# Altium schematic sheet FPGA.SchDoc
size C
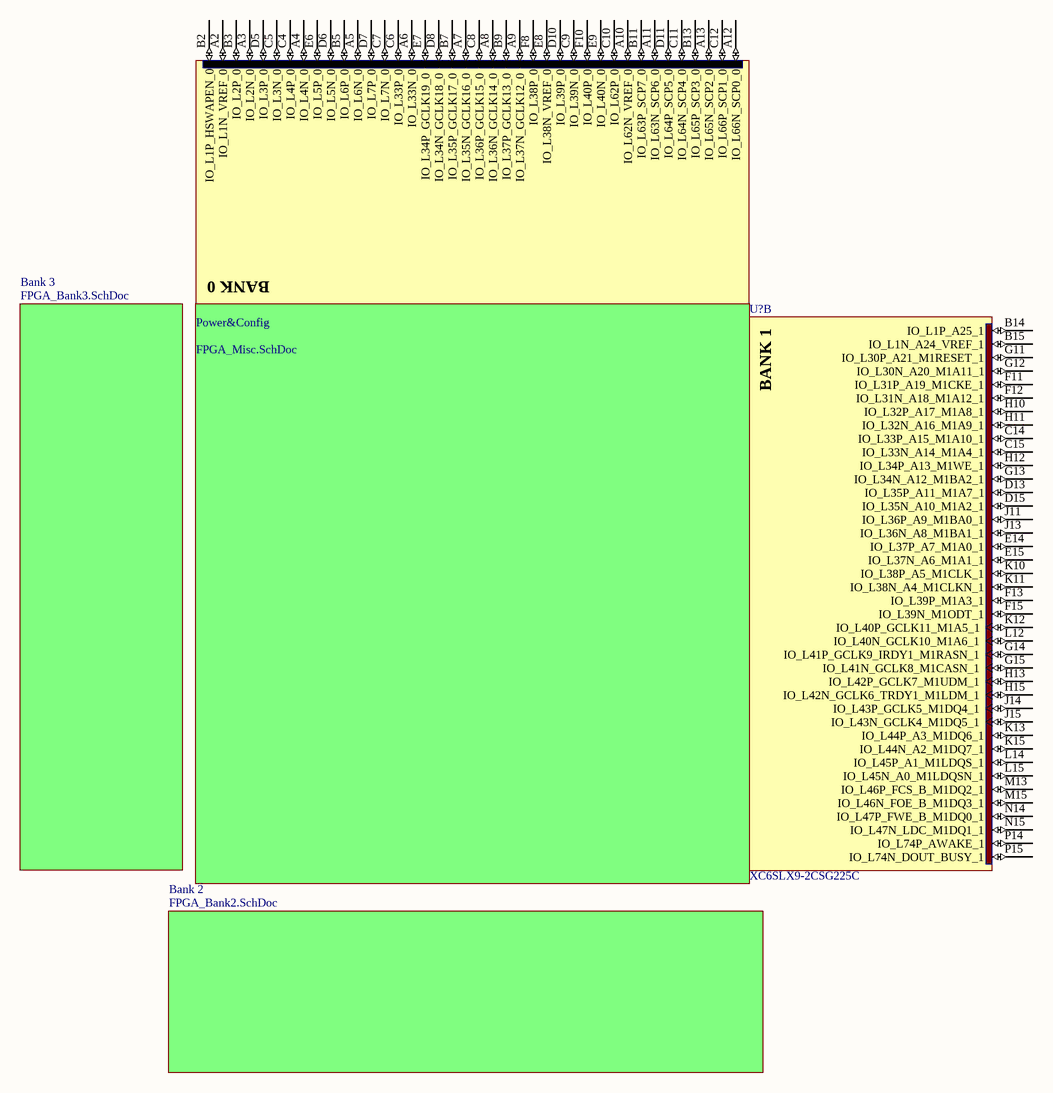
[diagram p0: FPGA.SchDoc]

## Parts
(Parts that share a designator on the sheet are numbered #1, #2 ... from top to bottom, then left to right.)
U?#1  XC6SLX9-2CSG225C  [CSG225]  (part A of 7)
U?#2  XC6SLX9-2CSG225C  [CSG225]  (part B of 7)

## Sub-sheets
Bank 2 = FPGA_Bank2.SchDoc: no entries
Bank 3 = FPGA_Bank3.SchDoc: no entries
Power&Config = FPGA_Misc.SchDoc: no entries

## Nets

Not connected (* = marked no-connect by the designer): U?#1 A2(IO_L1N_VREF_0) A3(IO_L2N_0) A4(IO_L4N_0) A5(IO_L6N_0) A6(IO_L33N_0) A7(IO_L35N_GCLK16_0) A8(IO_L36N_GCLK14_0) A9(IO_L37N_GCLK12_0) A10(IO_L62N_VREF_0) A11(IO_L63N_SCP6_0) A12(IO_L66N_SCP0_0) A13(IO_L65N_SCP2_0) B2(IO_L1P_HSWAPEN_0) B3(IO_L2P_0) B5(IO_L6P_0) B7(IO_L35P_GCLK17_0) B9(IO_L37P_GCLK13_0) B11(IO_L63P_SCP7_0) B13(IO_L65P_SCP3_0) C4(IO_L4P_0) C5(IO_L3N_0) C6(IO_L33P_0) C7(IO_L7N_0) C8(IO_L36P_GCLK15_0) C9(IO_L39N_0) C10(IO_L62P_0) C11(IO_L64N_SCP4_0) C12(IO_L66P_SCP1_0) D5(IO_L3P_0) D6(IO_L5N_0) D7(IO_L7P_0) D8(IO_L34N_GCLK18_0) D10(IO_L39P_0) D11(IO_L64P_SCP5_0) E6(IO_L5P_0) E7(IO_L34P_GCLK19_0) E8(IO_L38N_VREF_0) E9(IO_L40N_0) F8(IO_L38P_0) F10(IO_L40P_0); U?#2 B14(IO_L1P_A25_1) B15(IO_L1N_A24_VREF_1) C14(IO_L33P_A15_M1A10_1) C15(IO_L33N_A14_M1A4_1) D13(IO_L35P_A11_M1A7_1) D15(IO_L35N_A10_M1A2_1) E14(IO_L37P_A7_M1A0_1) E15(IO_L37N_A6_M1A1_1) F11(IO_L31P_A19_M1CKE_1) F12(IO_L31N_A18_M1A12_1) F13(IO_L39P_M1A3_1) F15(IO_L39N_M1ODT_1) G11(IO_L30P_A21_M1RESET_1) G12(IO_L30N_A20_M1A11_1) G13(IO_L34N_A12_M1BA2_1) G14(IO_L41P_GCLK9_IRDY1_M1RASN_1) G15(IO_L41N_GCLK8_M1CASN_1) H10(IO_L32P_A17_M1A8_1) H11(IO_L32N_A16_M1A9_1) H12(IO_L34P_A13_M1WE_1) H13(IO_L42P_GCLK7_M1UDM_1) H15(IO_L42N_GCLK6_TRDY1_M1LDM_1) J11(IO_L36P_A9_M1BA0_1) J13(IO_L36N_A8_M1BA1_1) J14(IO_L43P_GCLK5_M1DQ4_1) J15(IO_L43N_GCLK4_M1DQ5_1) K10(IO_L38P_A5_M1CLK_1) K11(IO_L38N_A4_M1CLKN_1) K12(IO_L40P_GCLK11_M1A5_1) K13(IO_L44P_A3_M1DQ6_1) K15(IO_L44N_A2_M1DQ7_1) L12(IO_L40N_GCLK10_M1A6_1) L14(IO_L45P_A1_M1LDQS_1) L15(IO_L45N_A0_M1LDQSN_1) M13(IO_L46P_FCS_B_M1DQ2_1) M15(IO_L46N_FOE_B_M1DQ3_1) N14(IO_L47P_FWE_B_M1DQ0_1) N15(IO_L47N_LDC_M1DQ1_1) P14(IO_L74P_AWAKE_1) P15(IO_L74N_DOUT_BUSY_1)

## Notes on the sheet
- (in symbol XC6SLX9-2CSG225C, part A) BANK 0
- (in symbol XC6SLX9-2CSG225C, part B) BANK 1

## Library data of the parts
U?#1 U?#2 = XC6SLX9-2CSG225C: Spartan-6 LX 1.2V FPGA, 160 User I/Os, 225-Ball Chip-Scale BGA (0.8mm Pitch), Speed Grade 2, Commercial Grade, Pb-Free; DatasheetVersion: ver1.6, Nov-2010; PackageVersion: ver1.1, Nov-2009; PackageReference: CSG225; PackageDescription: 225-Ball Chip-Scale BGA (CSG225) Package, 0.8 mm Pitch; Code_JEDEC: MO-275-HHAC-1; ComponentLink1Description: Manufacturer URL; ComponentLink1URL: http://www.xilinx.com/; ComponentLink2Description: Spartan-6 Datasheet; ComponentLink2URL: http://www.xilinx.com/support/documentation/data_sheets/ds160.pdf; ComponentLink3Description: Spartan-6 Documents; ComponentLink3URL: http://www.xilinx.com/support/documentation/spartan-6.htm